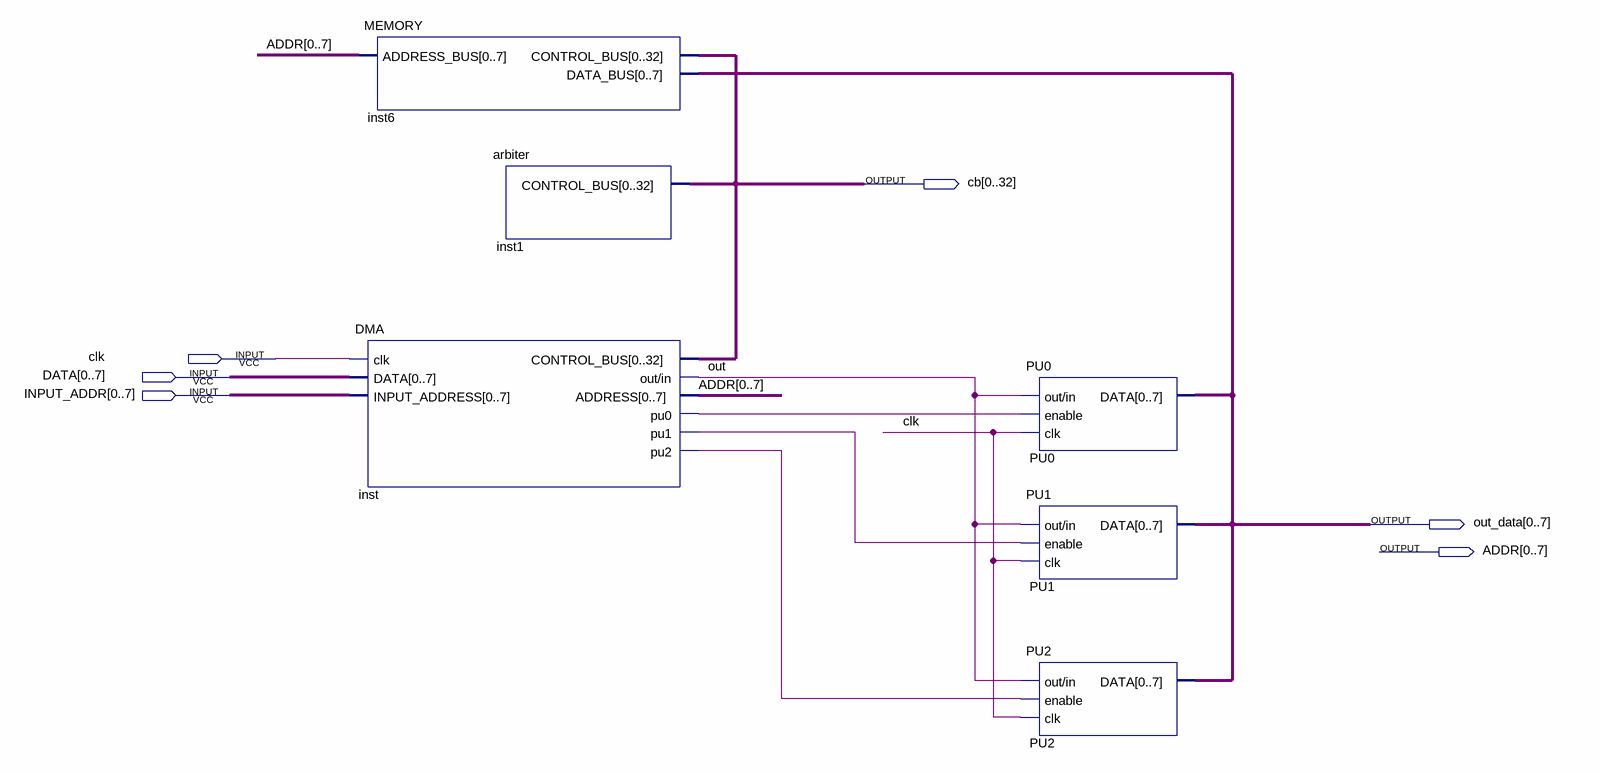
[diagram p0: schematic sheet]
// Quartus schematic TEST_DMA.bdf as structural Verilog: 6 symbols, 6 pins
module TEST_DMA (
  input  clk,
  input  [0:7] DATA,
  input  [0:7] INPUT_ADDR,
  output [0:32] cb,
  output [0:7] out_data,
  output [0:7] ADDR
);

  wire inst_pu0, inst_pu1, inst_pu2, out;

  MEMORY inst6 (.ADDRESS_BUS(ADDR), .CONTROL_BUS(cb), .DATA_BUS(out_data));
  DMA inst (
    .clk(clk), .DATA(DATA), .INPUT_ADDRESS(INPUT_ADDR), .\out/in (out), .ADDRESS(ADDR), .pu0(inst_pu0),
    .pu1(inst_pu1), .pu2(inst_pu2), .CONTROL_BUS(cb));
  arbiter inst1 (.CONTROL_BUS(cb));
  PU0 PU0 (.\out/in (out), .enable(inst_pu0), .clk(clk), .DATA(out_data));
  PU1 PU1 (.\out/in (out), .enable(inst_pu1), .clk(clk), .DATA(out_data));
  PU2 PU2 (.\out/in (out), .enable(inst_pu2), .clk(clk), .DATA(out_data));
endmodule
